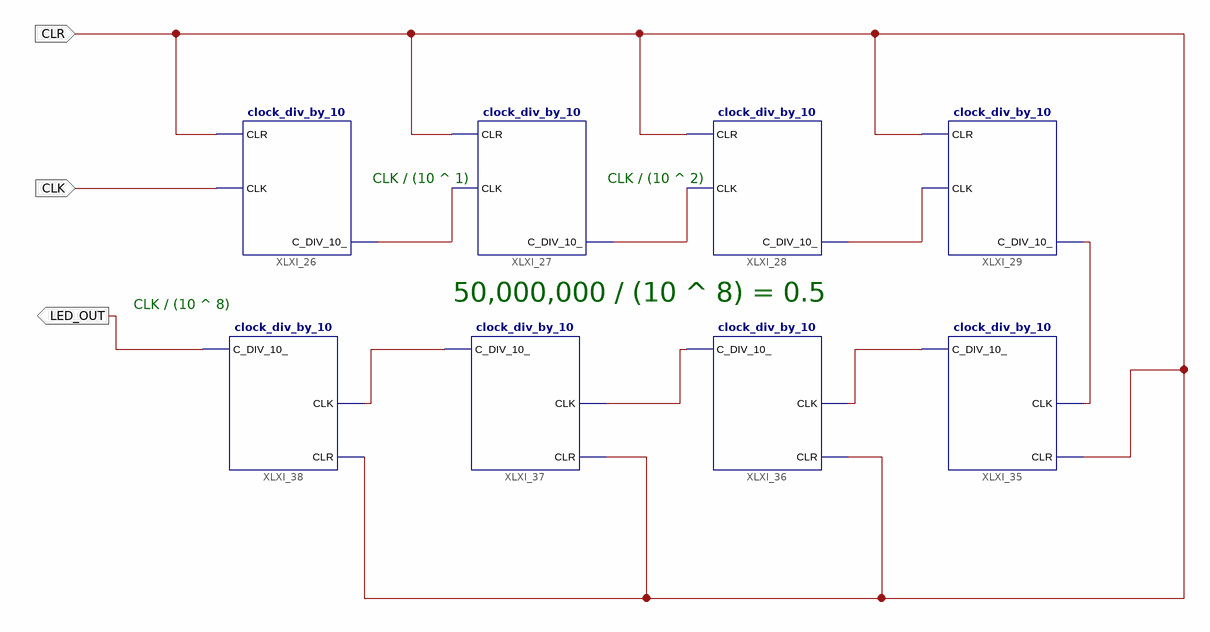
[diagram p0: schematic sheet 1]
// Xilinx ISE schematic dip_md2.sch (spartan3e) as structural Verilog: 8 symbols, 3 ports
module dip_md2 (
  input  CLR,
  input  CLK,
  output LED_OUT
);

  wire XLXN_158, XLXN_161, XLXN_162, XLXN_172, XLXN_173, XLXN_174, XLXN_189;

  clock_div_by_10 XLXI_26 (.CLR(CLR), .CLK(CLK), .C_DIV_10_(XLXN_158));
  clock_div_by_10 XLXI_27 (.CLR(CLR), .CLK(XLXN_158), .C_DIV_10_(XLXN_161));
  clock_div_by_10 XLXI_28 (.CLR(CLR), .CLK(XLXN_161), .C_DIV_10_(XLXN_162));
  clock_div_by_10 XLXI_29 (.CLR(CLR), .CLK(XLXN_162), .C_DIV_10_(XLXN_189));
  clock_div_by_10 XLXI_35 (.CLR(CLR), .CLK(XLXN_189), .C_DIV_10_(XLXN_172));
  clock_div_by_10 XLXI_36 (.CLR(CLR), .CLK(XLXN_172), .C_DIV_10_(XLXN_173));
  clock_div_by_10 XLXI_37 (.CLR(CLR), .CLK(XLXN_173), .C_DIV_10_(XLXN_174));
  clock_div_by_10 XLXI_38 (.CLR(CLR), .CLK(XLXN_174), .C_DIV_10_(LED_OUT));

  // Notes on the sheet:
  //   CLK / (10 ^ 1)
  //   CLK / (10 ^ 2)
  //   50,000,000 / (10 ^ 8) = 0.5
  //   CLK / (10 ^ 8)
endmodule
